# Altium project ADCS.PrjPcb
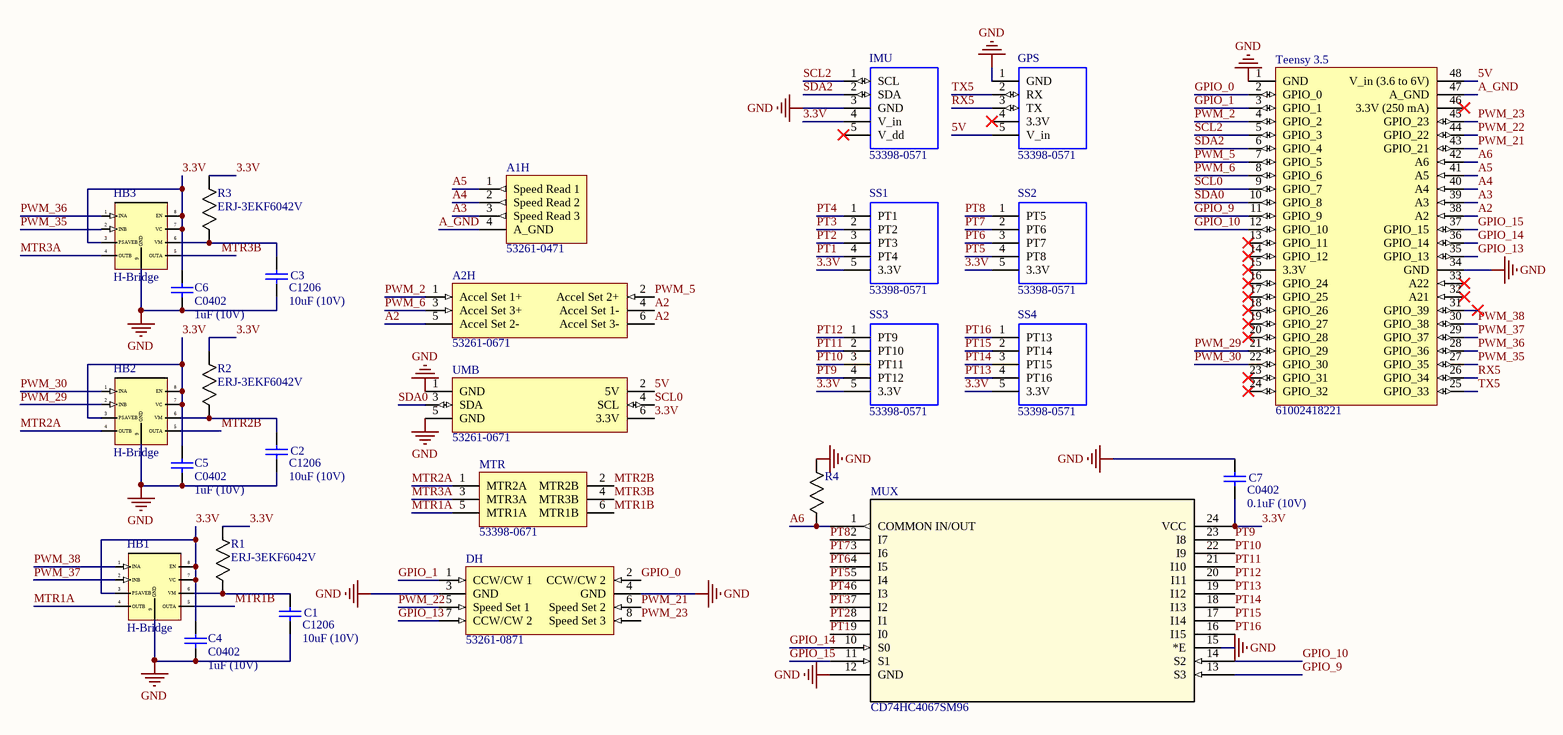
[diagram p0: Top.SchDoc]
1 sheet, 27 parts. Net scope: global (net labels, ports and power ports of the same name join across sheets).
Board file: ADCS.PcbDoc

## Sheet Top.SchDoc
size D

### Parts
A1H  53261-0471  [53261-0471]
A2H  53261-0671  [53261-0671]
C1  C1206  value 10uF (10V)  [CC1206N]
C2  C1206  value 10uF (10V)  [CC1206N]
C3  C1206  value 10uF (10V)  [CC1206N]
C4  C0402  value 1uF (10V)  [CC1206N]
C5  C0402  value 1uF (10V)  [CC1206N]
C6  C0402  value 1uF (10V)  [CC1206N]
C7  C0402  value 0.1uF (10V)  [CC1206N]
DH  53261-0871  [53261-0871]
GPS  53398-0571  [53398-0571]
HB1  H-Bridge  [AP1017]
HB2  H-Bridge  [AP1017]
HB3  H-Bridge  [AP1017]
IMU  53398-0571  [53398-0571]
MTR  53398-0671  [533980671]
MUX  CD74HC4067SM96  [CD74HC4067SM96]
R1  ERJ-3EKF6042V  [RC0603N]
R2  ERJ-3EKF6042V  [RC0603N]
R3  ERJ-3EKF6042V  [RC0603N]
R4  (no value)  [RC0603N]
SS1  53398-0571  [53398-0571]
SS2  53398-0571  [53398-0571]
SS3  53398-0571  [53398-0571]
SS4  53398-0571  [53398-0571]
Teensy_3.5  61002418221  [61002418221]
UMB  53261-0671  [53261-0671]

### Nets
GND: C1.1 C2.1 C3.1 C4.1 C5.1 C6.1 C7.2 DH.3(GND) DH.4(GND) GPS.1(GND) HB1.9(GND) HB2.9(GND) HB3.9(GND) IMU.3(GND) MUX.12(GND) MUX.15(*E) R4.1 Teensy_3.5.1(GND) Teensy_3.5.34(GND) UMB.1(GND) UMB.5(GND)
3.3V: C4.2 C5.2 C6.2 C7.1 HB1.3(PSAVEB) HB1.7(VC) HB1.8(EN) HB2.3(PSAVEB) HB2.7(VC) HB2.8(EN) HB3.3(PSAVEB) HB3.7(VC) HB3.8(EN) IMU.4(V_in) MUX.24(VCC) R1.1 R2.1 R3.1 SS1.5(3.3V) SS2.5(3.3V) SS3.5(3.3V) SS4.5(3.3V) UMB.6(3.3V)
5V: GPS.5(V_in) Teensy_3.5.48(V_in_(3.6_to_6V)) UMB.2(5V)
A2: A2H.4(Accel_Set_1-) A2H.5(Accel_Set_2-) A2H.6(Accel_Set_3-) Teensy_3.5.38(A2)
A3: A1H.3(Speed_Read_3) Teensy_3.5.39(A3)
A4: A1H.2(Speed_Read_2) Teensy_3.5.40(A4)
A5: A1H.1(Speed_Read_1) Teensy_3.5.41(A5)
A6: MUX.1(COMMON_IN/OUT) R4.2 Teensy_3.5.42(A6)
A_GND: A1H.4(A_GND) Teensy_3.5.47(A_GND)
GPIO_0: DH.2(CCW/CW_2) Teensy_3.5.2(GPIO_0)
GPIO_1: DH.1(CCW/CW_1) Teensy_3.5.3(GPIO_1)
GPIO_9: MUX.13(S3) Teensy_3.5.11(GPIO_9)
GPIO_10: MUX.14(S2) Teensy_3.5.12(GPIO_10)
GPIO_13: DH.7(CCW/CW_2) Teensy_3.5.35(GPIO_13)
GPIO_14: MUX.10(S0) Teensy_3.5.36(GPIO_14)
GPIO_15: MUX.11(S1) Teensy_3.5.37(GPIO_15)
MTR1A: HB1.4(OUTB) MTR.5(MTR1A)
MTR1B: HB1.5(OUTA) MTR.6(MTR1B)
MTR2A: HB2.4(OUTB) MTR.1(MTR2A)
MTR2B: HB2.5(OUTA) MTR.2(MTR2B)
MTR3A: HB3.4(OUTB) MTR.3(MTR3A)
MTR3B: HB3.5(OUTA) MTR.4(MTR3B)
PT1: MUX.9(I0) SS1.4(PT4)
PT2: MUX.8(I1) SS1.3(PT3)
PT3: MUX.7(I2) SS1.2(PT2)
PT4: MUX.6(I3) SS1.1(PT1)
PT5: MUX.5(I4) SS2.4(PT8)
PT6: MUX.4(I5) SS2.3(PT7)
PT7: MUX.3(I6) SS2.2(PT6)
PT8: MUX.2(I7) SS2.1(PT5)
PT9: MUX.23(I8) SS3.4(PT12)
PT10: MUX.22(I9) SS3.3(PT11)
PT11: MUX.21(I10) SS3.2(PT10)
PT12: MUX.20(I11) SS3.1(PT9)
PT13: MUX.19(I12) SS4.4(PT16)
PT14: MUX.18(I13) SS4.3(PT15)
PT15: MUX.17(I14) SS4.2(PT14)
PT16: MUX.16(I15) SS4.1(PT13)
PWM_2: A2H.1(Accel_Set_1+) Teensy_3.5.4(GPIO_2)
PWM_5: A2H.2(Accel_Set_2+) Teensy_3.5.7(GPIO_5)
PWM_6: A2H.3(Accel_Set_3+) Teensy_3.5.8(GPIO_6)
PWM_21: DH.6(Speed_Set_2) Teensy_3.5.43(GPIO_21)
PWM_22: DH.5(Speed_Set_1) Teensy_3.5.44(GPIO_22)
PWM_23: DH.8(Speed_Set_3) Teensy_3.5.45(GPIO_23)
PWM_29: HB2.2(INB) Teensy_3.5.21(GPIO_29)
PWM_30: HB2.1(INA) Teensy_3.5.22(GPIO_30)
PWM_35: HB3.2(INB) Teensy_3.5.27(GPIO_35)
PWM_36: HB3.1(INA) Teensy_3.5.28(GPIO_36)
PWM_37: HB1.2(INB) Teensy_3.5.29(GPIO_37)
PWM_38: HB1.1(INA) Teensy_3.5.30(GPIO_38)
RX5: GPS.3(TX) Teensy_3.5.26(GPIO_34)
SCL0: Teensy_3.5.9(GPIO_7) UMB.4(SCL)
SCL2: IMU.1(SCL) Teensy_3.5.5(GPIO_3)
SDA0: Teensy_3.5.10(GPIO_8) UMB.3(SDA)
SDA2: IMU.2(SDA) Teensy_3.5.6(GPIO_4)
TX5: GPS.2(RX) Teensy_3.5.25(GPIO_33)
NetC1_2: C1.2 HB1.6(VM) R1.2
NetC2_2: C2.2 HB2.6(VM) R2.2
NetC3_2: C3.2 HB3.6(VM) R3.2

Not connected (* = marked no-connect by the designer): GPS 4(3.3V)*; IMU 5(V_dd)*; Teensy_3.5 13(GPIO_11)* 14(GPIO_12)* 15(3.3V)* 16(GPIO_24)* 17(GPIO_25)* 18(GPIO_26)* 19(GPIO_27)* 20(GPIO_28)* 23(GPIO_31)* 24(GPIO_32)* 31(GPIO_39)* 32(A21)* 33(A22)* 46(3.3V_(250_mA))*

### Library data of the parts
A1H = 53261-0471: 4 way SMT r/a header Molex PICOBLADE Series, Series Number 53261, 1.25mm Pitch 4 Way 1 Row Shrouded Right Angle PCB Header, Surface Mount; Geometry.Height: mm; Supplier_Name: RS; RS Part Number: 5427113P; Manufacturer_Name: Molex; Manufacturer_Part_Number: 53261-0471; Allied_Number: *; Other Part Number: *; Datasheet Link: http://www.molex.com/webdocs/datasheets/pdf/en-us//0532610471_PCB_HEADERS.pdf; 3D Package: *
A2H UMB = 53261-0671: Molex PICOBLADE Series, Series Number 53261, 1.25mm Pitch 6 Way 1 Row Right Angle PCB Header, Solder Termination, 1A; Geometry.Height: mm; Supplier_Name: RS; RS Part Number: 5427135P; Manufacturer_Name: Molex; Manufacturer_Part_Number: 53261-0671; Allied_Number: *; Other Part Number: *; Datasheet Link: http://docs-europe.electrocomponents.com/webdocs/078f/0900766b8078fc7f.pdf; 3D Package: *
C1-C3 = C1206: Ceramic Chip Capacitor - Standard; Published: 17-Jul-2002; LatestRevisionDate: 19-Mar-2004; LatestRevisionNote: Silkscreen size reduced.; DatasheetDocument: Mar-2001; PackageDocument: Mar-2001; PackageReference: 1206; Publisher: Altium Limited; Code_JEITA: 1206; Code_IPC: 3216 [1206]; ComponentLink1Description: Manufacturer Link; ComponentLink1URL: http://www.kemet.com/; ComponentLink2Description: Datasheet; ComponentLink2URL: http://www.kemet.com/kemet/web/homepage/kechome.nsf/vapubfilesname/F3102TA.pdf/$file/F3102TA.pdf
C4-C7 = C0402: Ceramic Chip Capacitor - Standard; Note: Footprint corresponds to dimensions for bulk cassette packaging. This case size has tightened tolerances.; Published: 17-Jul-2002; LatestRevisionDate: 19-Mar-2004; LatestRevisionNote: Silkscreen size reduced.; DatasheetDocument: Mar-2001; PackageDocument: Mar-2001; PackageReference: 0402; Publisher: Altium Limited; Code_JEITA: 0402; Code_IPC: 1005 [0402]; ComponentLink1Description: Manufacturer Link; ComponentLink1URL: http://www.kemet.com/; ComponentLink2Description: Datasheet; ComponentLink2URL: http://www.kemet.com/kemet/web/homepage/kechome.nsf/vapubfilesname/F3102TA.pdf/$file/F3102TA.pdf
DH = 53261-0871: Molex PICOBLADE Series, Series Number 53261, 1.25mm Pitch, 8 Way 1 Row Shrouded Right Angle PCB Header, Surface Mount; Geometry.Height: mm; Supplier_Name: RS; RS Part Number: 5427157P; Manufacturer_Name: Molex; Manufacturer_Part_Number: 53261-0871; Allied_Number: *; Other Part Number: *; Datasheet Link: http://www.molex.com/webdocs/datasheets/pdf/en-us/0532610871_PCB_HEADERS.pdf; 3D Package: *
GPS IMU SS1-SS4 = 53398-0571: Molex PICOBLADE Series, Series Number 53398, 1.25mm Pitch 5 Way 1 Row Straight PCB Header, Solder Termination, 1A; Geometry.Height: mm; Supplier_Name: RS; RS Part Number: 5427292; Manufacturer_Name: Molex; Manufacturer_Part_Number: 53398-0571; Allied_Number: *; Other Part Number: *; Datasheet Link: http://www.molex.com/pdm_docs/sd/533980571_sd.pdf; 3D Package: *
HB1-HB3 = AP1017AEN
MTR = 53398-0671: Molex PICOBLADE Series, Series Number 53398, 1.25mm Pitch 6 Way 1 Row Straight PCB Header, Solder Termination, 1A; Allied_Number: 70090674; Geometry.Height: mm; Supplier_Name: RS; RS Part Number: 5427214P; Manufacturer_Name: Molex; Manufacturer_Part_Number: 53398-0671; Other Part Number: *; Datasheet Link: http://docs-europe.electrocomponents.com/webdocs/13c4/0900766b813c4502.pdf; 3D Package: *
R1-R4 = ERJ-3EKF6042V: Imported; Vendor: Panasonic; Built_By: EMA_UL_Team; C: Copyright (C) 2015 Accelerated Designs. All rights reserved; Manufacturer_Part_Number: ERJ-3EKF6042V; Value: Value
Teensy_3.5 = 61002418221: Wurth Elektronik WR-PHD Series, Series Number 6100, 2.54mm Pitch 24 Way 1 Row Right Angle PCB Header; Manufacturer_Name: WÃ¼rth Elektronik; Geometry.Height: mm; Supplier_Name: RS; RS Part Number: 1216841; Manufacturer_Part_Number: 61002418221; Allied_Number: *; Other Part Number: *; Datasheet Link: http://katalog.we-online.de/em/datasheet/6100xx18221.pdf; 3D Package: *